# Altium schematic sheet MCU.SchDoc
size 420 x 297 mm; DocumentNumber: 4; SheetNumber: 4; SheetTotal: 5; Обозначение_Код: RIG-00.00.001 Э3
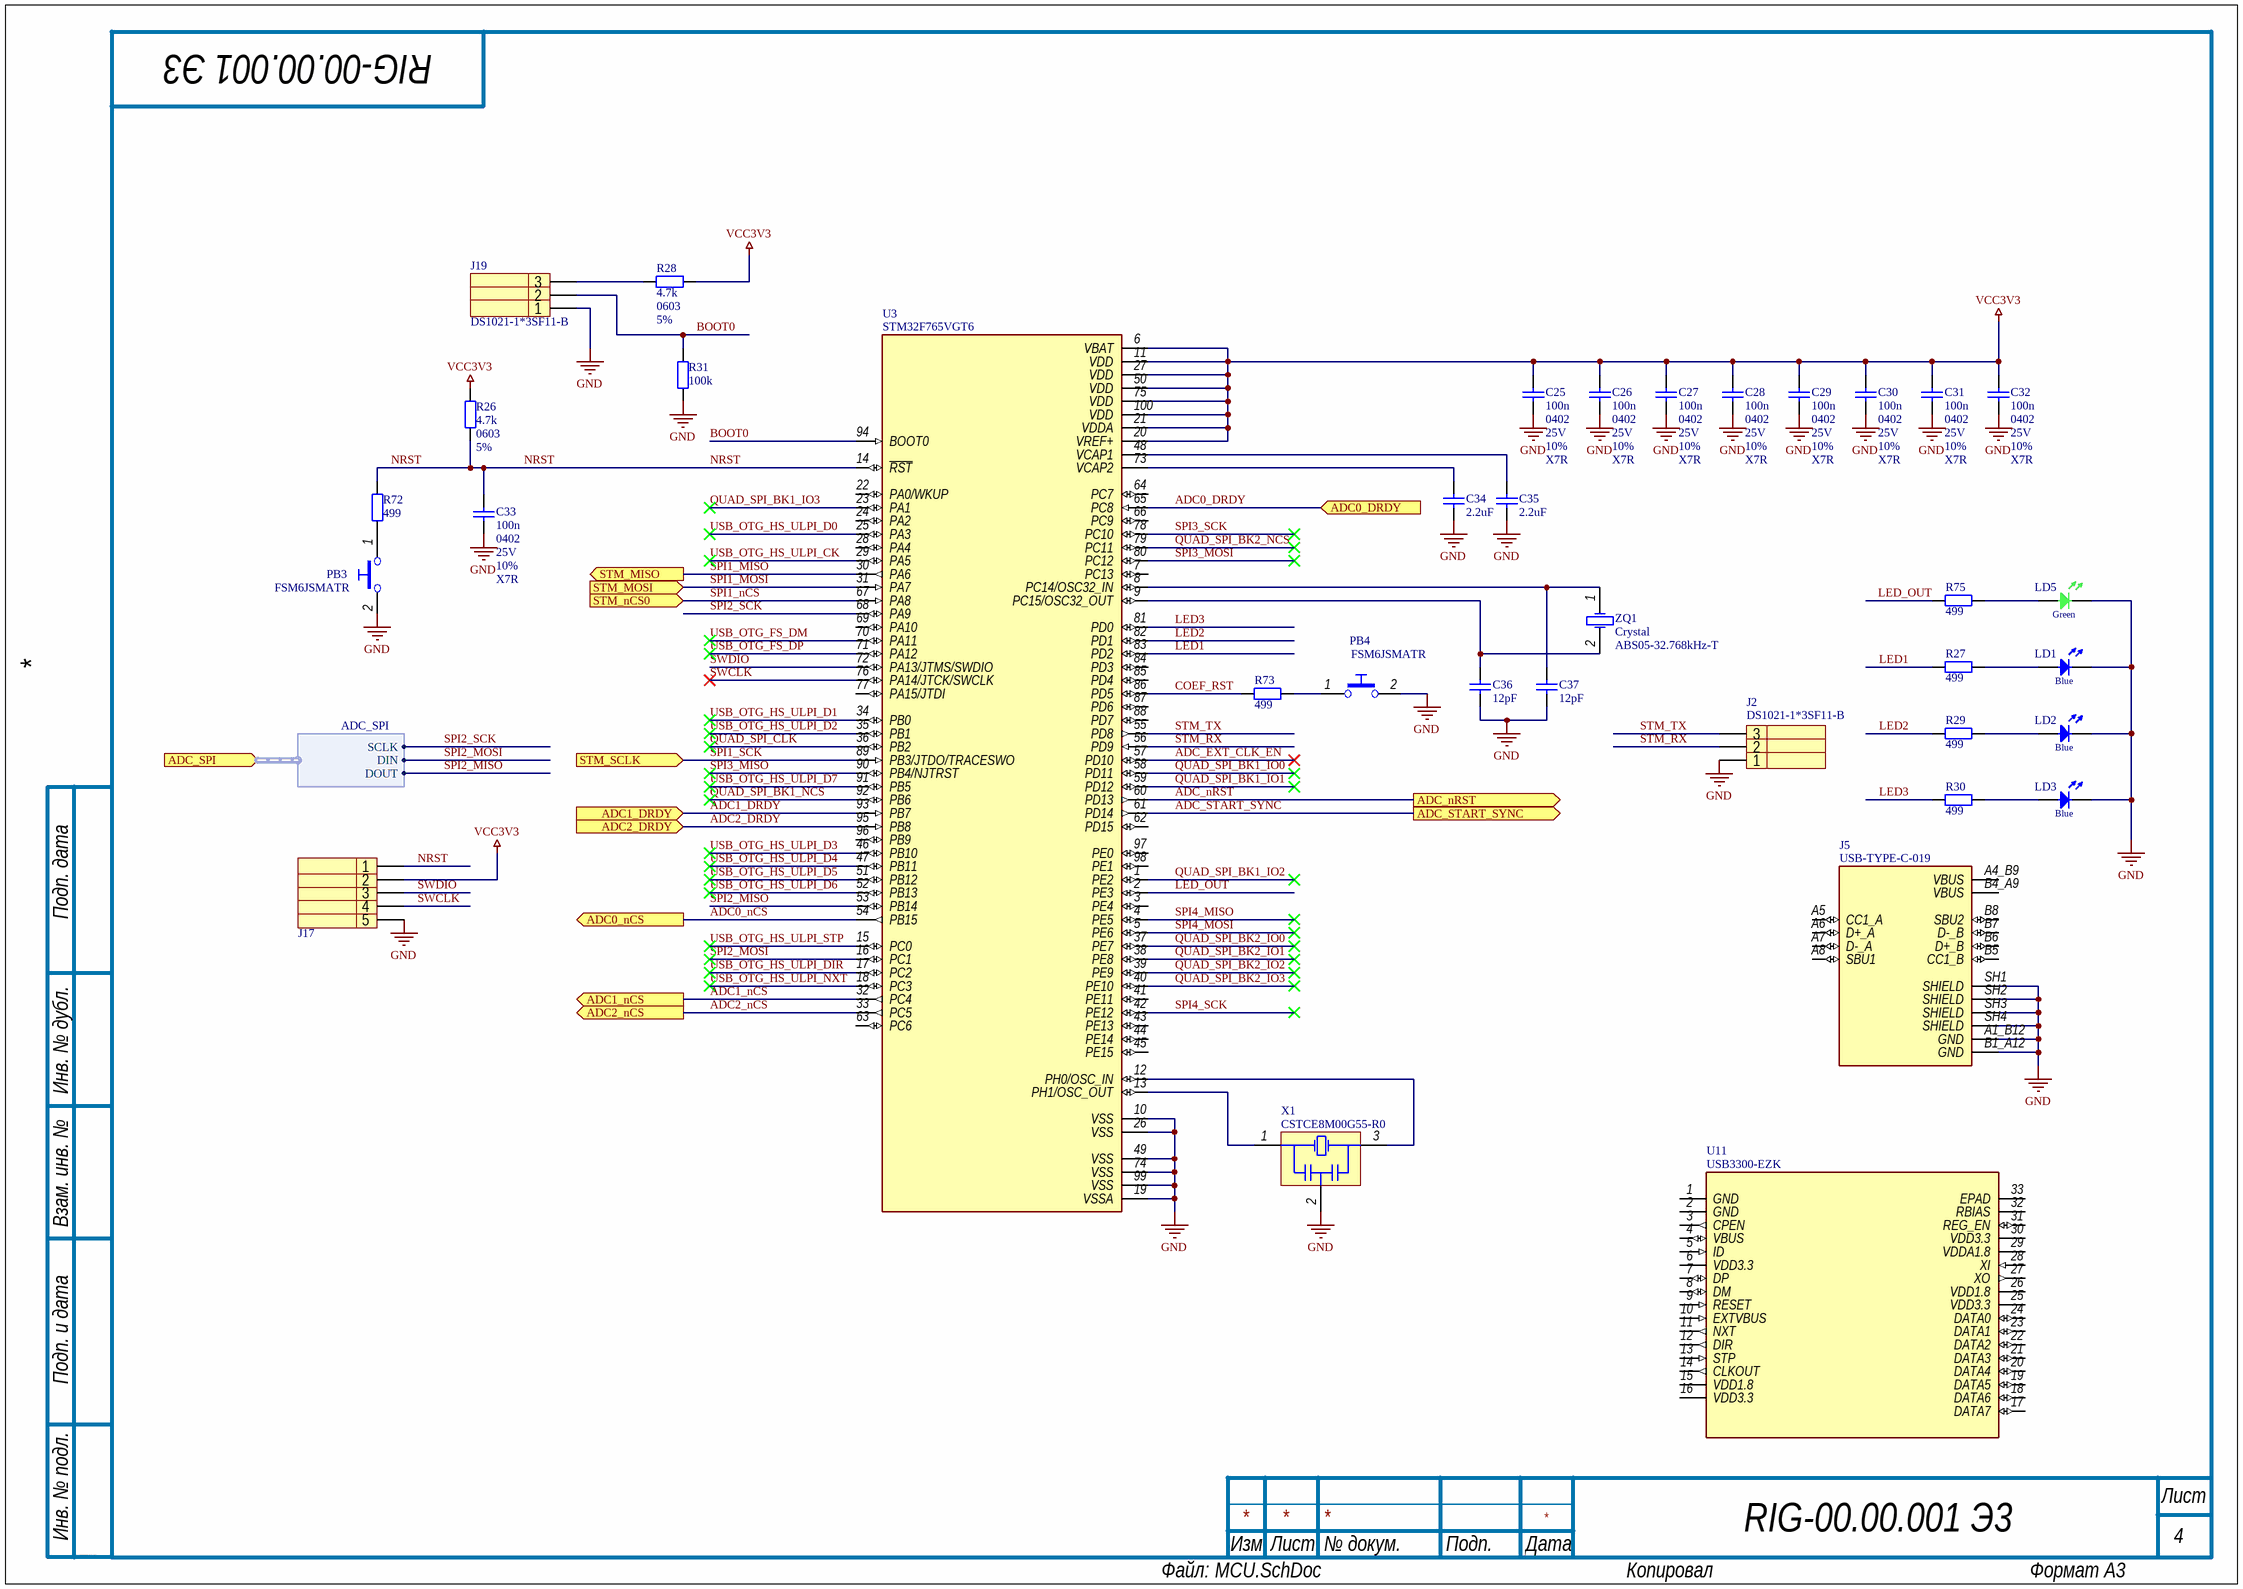
[diagram p0: MCU.SchDoc]

## Parts
C25  100n  Device: 0402  Voltage: 25V  Tolerance: 10%  Dielectric Type: X7R  [CAPC1005X55N]
C26  100n  Device: 0402  Voltage: 25V  Tolerance: 10%  Dielectric Type: X7R  [CAPC1005X55N]
C27  100n  Device: 0402  Voltage: 25V  Tolerance: 10%  Dielectric Type: X7R  [CAPC1005X55N]
C28  100n  Device: 0402  Voltage: 25V  Tolerance: 10%  Dielectric Type: X7R  [CAPC1005X55N]
C29  100n  Device: 0402  Voltage: 25V  Tolerance: 10%  Dielectric Type: X7R  [CAPC1005X55N]
C30  100n  Device: 0402  Voltage: 25V  Tolerance: 10%  Dielectric Type: X7R  [CAPC1005X55N]
C31  100n  Device: 0402  Voltage: 25V  Tolerance: 10%  Dielectric Type: X7R  [CAPC1005X55N]
C32  100n  Device: 0402  Voltage: 25V  Tolerance: 10%  Dielectric Type: X7R  [CAPC1005X55N]
C33  100n  Device: 0402  Voltage: 25V  Tolerance: 10%  Dielectric Type: X7R  [CAPC1005X55N]
C34  2.2uF  [CAPC1005X55N]
C35  2.2uF  [CAPC1005X55N]
C36  12pF  [CAPC1005X55N]
C37  12pF  [CAPC1005X55N]
J2  DS1021-1*3SF11-B  [PLS-3]
J5  USB-TYPE-C-019  [AMPHENOL_12402012E212A]
J17  DS1021-1*5SF11-B  [PLS-5]  (value not drawn)
J19  DS1021-1*3SF11-B  [PLS-3]
LD1  Blue  [0603(LED_B)]  (value not drawn)
LD2  Blue  [0603(LED_B)]  (value not drawn)
LD3  Blue  [0603(LED_B)]  (value not drawn)
LD5  Green  [LD-3mm-G]  (value not drawn)
PB3  FSM6JSMATR  [FSMxJSMA-Series]
PB4  FSM6JSMATR  [FSMxJSMA-Series]
R26  4.7k  Device: 0603  Tolerance: 5%  [RESC1608X50N]
R27  499  [RESC1005X40N]
R28  4.7k  Device: 0603  Tolerance: 5%  [RESC1608X50N]
R29  499  [RESC1005X40N]
R30  499  [RESC1005X40N]
R31  100k  [RESC1005X40N]
R72  499  [RESC1005X40N]
R73  499  [RESC1005X40N]
R75  499  [RESC1005X40N]
U3  STM32F765VGT6  [LQFP100_L]
U11  USB3300-EZK  [QFN32_5X5MC_MCH]
X1  CSTCE8M00G55-R0  [MURA-CSTCE_G_A-3_V]
ZQ1  Crystal  Part Number: ABS05-32.768kHz-T  [FP-ABS05-MFG]

## Ports
ADC0_DRDY (in), ADC0_nCS (out), ADC1_DRDY (in), ADC1_nCS (out), ADC2_DRDY (in), ADC2_nCS (out), ADC_nRST (out), ADC_SPI (in, harness ADC_SPI), ADC_START_SYNC (out), STM_MISO (out), STM_MOSI (in), STM_nCS0 (in), STM_SCLK (in)

## Harnesses
ADC_SPI: DIN, DOUT, SCLK

## Nets
GND: C25.1 C26.1 C27.1 C28.1 C29.1 C30.1 C31.1 C32.1 C33.1 C34.1 C35.1 C36.1 C37.1 J2.1 J5.A1_B12(GND) J5.B1_A12(GND) J5.SH1(SHIELD) J5.SH2(SHIELD) J5.SH3(SHIELD) J5.SH4(SHIELD) J17.5 J19.1 LD1.2(C) LD2.2(C) LD3.2(C) LD5.2(C) PB3.2 PB4.2 R31.1 U3.10(VSS) U3.19(VSSA) U3.26(VSS) U3.49(VSS) U3.74(VSS) U3.99(VSS) X1.2(GND)
VCC3V3: C25.2 C26.2 C27.2 C28.2 C29.2 C30.2 C31.2 C32.2 J17.2 R26.2 R28.2 U3.6(VBAT) U3.11(VDD) U3.20(VREF+) U3.21(VDDA) U3.27(VDD) U3.50(VDD) U3.75(VDD) U3.100(VDD)
ADC0_DRDY: U3.65(PC8) ; port ADC0_DRDY
ADC0_nCS: U3.54(PB15) ; port ADC0_nCS
ADC1_DRDY: U3.93(PB7) ; port ADC1_DRDY
ADC1_nCS: U3.32(PC4) ; port ADC1_nCS
ADC2_DRDY: U3.95(PB8) ; port ADC2_DRDY
ADC2_nCS: U3.33(PC5) ; port ADC2_nCS
ADC_EXT_CLK_EN: U3.57(PD10)
ADC_nRST: U3.60(PD13) ; port ADC_nRST
ADC_START_SYNC: U3.61(PD14) ; port ADC_START_SYNC
BOOT0: J19.2 R31.2 U3.94(BOOT0)
COEF_RST: R73.2 U3.86(PD5)
LED1: R27.1 U3.83(PD2)
LED2: R29.1 U3.82(PD1)
LED3: R30.1 U3.81(PD0)
LED_OUT: R75.1 U3.2(PE3)
NRST: C33.2 J17.1 R26.1 R72.2 U3.14(~{RST})
QUAD_SPI_BK1_IO0: U3.58(PD11)
QUAD_SPI_BK1_IO1: U3.59(PD12)
QUAD_SPI_BK1_IO2: U3.1(PE2)
QUAD_SPI_BK1_IO3: U3.23(PA1)
QUAD_SPI_BK1_NCS: U3.92(PB6)
QUAD_SPI_BK2_IO0: U3.37(PE7)
QUAD_SPI_BK2_IO1: U3.38(PE8)
QUAD_SPI_BK2_IO2: U3.39(PE9)
QUAD_SPI_BK2_IO3: U3.40(PE10)
QUAD_SPI_BK2_NCS: U3.79(PC11)
QUAD_SPI_CLK: U3.36(PB2)
SPI1_MISO: U3.30(PA6) ; port STM_MISO
SPI1_MOSI: U3.31(PA7) ; port STM_MOSI
SPI1_nCS: U3.67(PA8) ; port STM_nCS0
SPI1_SCK: U3.89(PB3/JTDO/TRACESWO) ; port STM_SCLK
SPI2_MISO: U3.53(PB14) ; port ADC_SPI.DOUT
SPI2_MOSI: U3.16(PC1) ; port ADC_SPI.DIN
SPI2_SCK: U3.68(PA9) ; port ADC_SPI.SCLK
SPI3_MISO: U3.90(PB4/NJTRST)
SPI3_MOSI: U3.80(PC12)
SPI3_SCK: U3.78(PC10)
SPI4_MISO: U3.4(PE5)
SPI4_MOSI: U3.5(PE6)
SPI4_SCK: U3.42(PE12)
STM_RX: J2.2 U3.56(PD9)
STM_TX: J2.3 U3.55(PD8)
SWCLK: J17.4 U3.76(PA14/JTCK/SWCLK)
SWDIO: J17.3 U3.72(PA13/JTMS/SWDIO)
USB_OTG_FS_DM: U3.70(PA11)
USB_OTG_FS_DP: U3.71(PA12)
USB_OTG_HS_ULPI_CK: U3.29(PA5)
USB_OTG_HS_ULPI_D0: U3.25(PA3)
USB_OTG_HS_ULPI_D1: U3.34(PB0)
USB_OTG_HS_ULPI_D2: U3.35(PB1)
USB_OTG_HS_ULPI_D3: U3.46(PB10)
USB_OTG_HS_ULPI_D4: U3.47(PB11)
USB_OTG_HS_ULPI_D5: U3.51(PB12)
USB_OTG_HS_ULPI_D6: U3.52(PB13)
USB_OTG_HS_ULPI_D7: U3.91(PB5)
USB_OTG_HS_ULPI_DIR: U3.17(PC2)
USB_OTG_HS_ULPI_NXT: U3.18(PC3)
USB_OTG_HS_ULPI_STP: U3.15(PC0)
NetC34_2: C34.2 U3.73(VCAP2)
NetC35_2: C35.2 U3.48(VCAP1)
NetC36_2: C36.2 U3.9(PC15/OSC32_OUT) ZQ1.2(OSC2)
NetC37_2: C37.2 U3.8(PC14/OSC32_IN) ZQ1.1(OSC1)
NetJ19_3: J19.3 R28.1
NetLD1_1: LD1.1(A) R27.2
NetLD2_1: LD2.1(A) R29.2
NetLD3_1: LD3.1(A) R30.2
NetLD5_1: LD5.1(A) R75.2
NetPB3_1: PB3.1 R72.1
NetPB4_1: PB4.1 R73.1
NetU3_12: U3.12(PH0/OSC_IN) X1.3(X2)
NetU3_13: U3.13(PH1/OSC_OUT) X1.1(X1)

Not connected (* = marked no-connect by the designer): J5 A4_B9(VBUS) A5(CC1_A) A6(D+_A) A7(D-_A) A8(SBU1) B4_A9(VBUS) B5(CC1_B) B6(D+_B) B7(D-_B) B8(SBU2); U3 3(PE4) 7(PC13) 22(PA0/WKUP) 24(PA2) 28(PA4) 41(PE11) 43(PE13) 44(PE14) 45(PE15) 62(PD15) 63(PC6) 64(PC7) 66(PC9) 69(PA10) 77(PA15/JTDI) 84(PD3) 85(PD4) 87(PD6) 88(PD7) 96(PB9) 97(PE0) 98(PE1); U11 1(GND) 2(GND) 3(CPEN) 4(VBUS) 5(ID) 6(VDD3.3) 7(DP) 8(DM) 9(RESET) 10(EXTVBUS) 11(NXT) 12(DIR) 13(STP) 14(CLKOUT) 15(VDD1.8) 16(VDD3.3) 17(DATA7) 18(DATA6) 19(DATA5) 20(DATA4) 21(DATA3) 22(DATA2) 23(DATA1) 24(DATA0) 25(VDD3.3) 26(VDD1.8) 27(XO) 28(XI) 29(VDDA1.8) 30(VDD3.3) 31(REG_EN) 32(RBIAS) 33(EPAD)

## Notes on the sheet
- Подп. дата
- Инв. № дубл.
- Взам. инв. №
- Подп. и дата
- Инв. № подл.
- Изм.
- Лист
- № докум.
- Подп.
- Дата
- ALTIUM GOSTBOM2.0 KEV
- Файл:
- Копировал
- Формат А3

## Library data of the parts
C25-C33 = GRM155R71E104KE14D: CAP CER 0402 100n 25V X7R; Manufacturer: Murata; ID: 4; Type: Resistor; Packaging Type: Cut Tape; Working Temperature Min: -55°С; Working Temperature Max: +125°С; Table: Capacitor SMT - Керамические; Part Number: GRM155R71E104KE14D; Value: 100n; Series: GRM; SMD: Yes; Manufacturer Part Number: GRM155R71E104KE14D; Status: Active; Price: 0; Price2: 0; Price3: 0; Author: Krepak V.; CreateDate: 23.02.2020
C34 C35 = GRM155R61A225KE95D: CAP CER 0402 2.2uF 10V X5R; Manufacturer: Murata; ID: 36; Device: 0402; Tolerance: 10%; Type: Resistor; Packaging Type: Cut Tape; Working Temperature Min: -55°С; Working Temperature Max: +85°С; Table: Capacitor SMT - Керамические; Part Number: GRM155R61A225KE95D; Value: 2.2uF; Voltage: 10V; Dielectric Type: X5R; Series: GRM; SMD: Yes; Manufacturer Part Number: GRM155R61A225KE95D; Datasheet URL: #https://search.murata.co.jp/Ceramy/image/img/A01X/G101/ENG/GRM155R61A225KE95-01.pdf#; Status: Active; Price: 0; Price2: 0; Price3: 0; Author: Krepak V.; CreateDate: 31.03.2021
C36 C37 = GRM1555C1H120JA01D: CAP CER 0402 12pF 50V NP0; Manufacturer: Murata; ID: 49; Device: 0402; Tolerance: 5%; Type: Resistor; Packaging Type: Tape&Reel; Working Temperature Min: -55°С; Working Temperature Max: +125°С; Table: Capacitor SMT - Керамические; Part Number: GRM1555C1H120JA01D; Value: 12pF; Voltage: 50V; Dielectric Type: NP0; Series: GRM; SMD: Yes; Manufacturer Part Number: GRM1555C1H120JA01D; Datasheet URL: #https://search.murata.co.jp/Ceramy/image/img/A01X/G101/ENG/GRM1555C1H120JA01-01.pdf#; Status: Not recommended; Price: 0; Price2: 0; Price3: 0; Author: Krepak V.; CreateDate: 22.04.2021; Supplier 1: Digikey; Supplier Part Number 1: 490-5924-2-ND
J2 J19 = DS1021-1*3SF11-B: Manufacturer: CONNFLY; ID: 13; Limit Voltage: 500 V AC(1 min); Resistance: 20 mOhm(max); Pitch: 2.54mm; Working Temperature Min: -20°С; Working Temperature Max: +70°С; Table: Connectors - Общ; Part Number: DS1021-1*3SF11-B; Device: PLS-3; Pins: 3; Type: Connector; SMD: No; Datasheet URL: #https://static.chipdip.ru/lib/227/DOC000227157.pdf#; Status: Active; Price: 0; Price2: 0; Price3: 0; Author: Arshanitsa D.; CreateDate: 19.08.2020
J5 = USB-TYPE-C-019: 1 16P -25℃~+85℃ Type-C SMD USB, DVI, HDMI Connector Assemblies RoHS; MF: Amphenol ICC (Commercial Products); ID: 36; Table: Connectors - Интерфейсы; MP: 12402012E212A; Price: 0; Package: None; Availability: In Stock; SnapEDA_Link: https://www.snapeda.com/parts/12402012E212A/Amphenol/view-part/?ref=snap; Check_prices: https://www.snapeda.com/parts/12402012E212A/Amphenol/view-part/?ref=eda; Purchase-URL: https://pricing.snapeda.com/search/part/12402012E212A/?ref=eda; Part Number: USB-TYPE-C-019; Device: USB-TYPE-C-019; Pins: 16+8; Type: Connector; Price2: 0; Price3: 0
J17 = DS1021-1*5SF11-B: Manufacturer: CONNFLY; ID: 12; Limit Voltage: 500 V AC (1 min); Resistance: 20 mOhm(max); Pitch: 2.54mm; Working Temperature Min: -20; Working Temperature Max: +70°С; Table: Connectors - Общ; Part Number: DS1021-1*5SF11-B; Device: PLS-5; Pins: 5; Type: Connector; SMD: No; Datasheet URL: #https://static.chipdip.ru/lib/227/DOC000227157.pdf#; Status: Active; Price: 0; Price2: 0; Price3: 0; Author: Arshanitsa D.; CreateDate: 09.06.2020
LD1-LD3 = LTST-C191TBKT-5A: DIODE LTST-C191TBKT-5A; ID: 9; Packaging Type: Cut Tape; Table: Diodes SMT - Светодиоды; Part Number: LTST-C191TBKT-5A; Device: LTST-C191TBKT-5A; Value: LTST-C191TBKT-5A; Color: Blue; Type: Diode; SMD: Yes; Manufacturer Part Number: LTST-C191TBKT-5A; Datasheet URL: #https://jlcpcb.com/partdetail/liteon-LTST_C191TBKT5A/C161620#; Status: Active; Price: 0; Price2: 0; Price3: 0; Author: Krepak V.; CreateDate: 18.02.2024
LD5 = GNL-3012GD: DIODE GREEN; Manufacturer: G-NOR OPTOELECTRONICS; ID: 2; Reverse Voltage: 5V; Reverse Current: 10uA; Forward Current: 30mA; Luminous Flux: 7uCd; Number of LEDs: 1; Notes: 565nm 60deg; Packaging Type: Bulk; Table: Diodes THM - Светодиоды; Part Number: GNL-3012GD; Device: GREEN; Color: Green; Series: GNL-3012xx; Type: Diode; SMD: No; Manufacturer Part Number: GNL-3012GD; Datasheet URL: #https://static.chipdip.ru/lib/773/DOC002773602.pdf#; Status: Active; Distributor: chipdip; Price: 0; Price2: 0; Price3: 0; DistributorURL: #https://www.chipdip.ru/product/gnl-3012gd#; Author: Krepak V.; CreateDate: 25.08.2020; LatestRevisionDate: 25.08.2020
PB3 PB4 = FSM6JSMATR: Tactile Switch SPST-NO Top Actuated Surface Mount; Manufacturer: Te Connectivity; ID: 3; Device: TACT; Limit Voltage: 24VDC; Limit Current: 50mA; Working Temperature Min: -35°С; Working Temperature Max: +85°С; Table: Misc - Переключатели Кнопочные; Part Number: FSM6JSMATR; Series: FSMJSM; Type: Misc; SMD: Yes; Manufacturer Part Number: FSM6JSMATR; Datasheet URL: #https://www.terraelectronica.ru/pdf/show?pdf_file=http%253A%252F%252Fwww.farnell.com%252Fcad%252F1922404.pdf#; Status: Active; Distributor: terraelectronica; Price: 0; Price2: 0; Price3: 0; DistributorURL: #https://www.terraelectronica.ru/product/972320#; Author: Krepak V.; CreateDate: 31.08.2020
R26 R28 = RC0603JR-074K7L: RES 0603 4.7k 5%; Manufacturer: Yageo; ID: 29; Limit Voltage: 75V; Temperature Coefficient: 100ppm; Total Power Dissipation: 0.1W; Packaging Type: Cut Tape; Replacement: CR-03JL7---4K7, CRCW06034K70JNEA; Library Ref 2: Resistor2; Library Ref 3: Resistor3; Library Path 2: Resistors.SchLib; Application Category: 1; Working Temperature Min: -55°С; Working Temperature Max: +155°С; Table: Resistor SMT - Постоянные; Part Number: RC0603JR-074K7L; Value: 4.7k; Series: RC; Type: Resistor; Material: Thick-Film; SMD: Yes; Manufacturer Part Number: RC0603JR-074K7L; Datasheet URL: #https://www.terraelectronica.ru/pdf/show?pdf_file=%252Fds%252Fpdf%252FR%252FRC0603%255B1%255D.pdf#; Status: Active; Distributor: terraelectronica; Price: 0; Price2: 0; Price3: 0; DistributorURL: #https://www.terraelectronica.ru/product/540975#; Author: Krepak V.; CreateDate: 06.07.2020
R27 R29 R30 R72 R73 R75 = RC0402FR-07499RL: RES 0402 499 1%; Manufacturer: Yageo; ID: 90; Device: 0402; Limit Voltage: 50V; Temperature Coefficient: 100ppm; Total Power Dissipation: 0.0625W; Packaging Type: Tape&Reel; Library Ref 2: Resistor2; Library Ref 3: Resistor3; Library Path 2: Resistors.SchLib; Application Category: 1; Working Temperature Min: -55°С; Working Temperature Max: +155°С; Table: Resistor SMT - Постоянные; Part Number: RC0402FR-07499RL; Value: 499; Tolerance: 1%; Series: RC_L; Type: Resistor; Material: Thick-Film; SMD: Yes; Manufacturer Part Number: RC0402FR-07499RL; Datasheet URL: #https://www.yageo.com/upload/media/product/productsearch/datasheet/rchip/PYu-RC_Group_51_RoHS_L_11.pdf#; Status: Active; Distributor2: Jul. 7, 2020 V.11; Price: 0; Price2: 0; Price3: 0; Author: Krepak V.; CreateDate: 01.02.2022; Supplier 1: Digikey; Supplier Part Number 1: 311-499LRTR-ND
R31 = RC0402FR-07100KL: RES 0402 100k 1%; Manufacturer: Yageo; ID: 2; Device: 0402; Limit Voltage: 50V; Temperature Coefficient: 100ppm; Total Power Dissipation: 0.0625W; Packaging Type: Cut Tape; Library Ref 2: Resistor2; Library Ref 3: Resistor3; Library Path 2: Resistors.SchLib; Application Category: 1; Working Temperature Min: -55°С; Working Temperature Max: +155°С; Table: Resistor SMT - Постоянные; Part Number: RC0402FR-07100KL; Value: 100k; Tolerance: 1%; Series: RC; Type: Resistor; Material: Thick-Film; SMD: Yes; Price: 0; Price2: 0; Price3: 0; Author: Krepak V.; CreateDate: 23.02.2020
U3 = STM32F765VGT6: ARM® Cortex®-M7 STM32F7 Microcontroller IC 32-Bit Single-Core 216MHz 1MB (1M x 8) FLASH 100-LQFP (14x14); Manufacturer: ST Microelectronics; MF: STMicroelectronics; MP: STM32F765VGT6TR; ID: 12; Supply Operation: 1.7V ~ 3.6V; SRAM: 512K x 8; Prog Interface: SWD, JTAG; I/O Lines: 82; Packaging Type: Tape&Reel; Working Temperature Min: -40°С; Working Temperature Max: +85°С; Table: IC - Микроконтроллеры; Package: LQFP-100 STMicroelectronics; Price: 0; Check_prices: https://www.snapeda.com/parts/STM32F765VGT6TR/STMicroelectronics/view-part/?ref=eda; Value: 100-LQFP; SnapEDA_Link: https://www.snapeda.com/parts/STM32F765VGT6TR/STMicroelectronics/view-part/?ref=snap; Availability: In Stock; Purchase-URL: https://pricing.snapeda.com/search?q=STM32F765VGT6TR&ref=eda; Part Number: STM32F765VGT6; Device: STM32F765VGT6; Series: STM32F7; Flash: 1MB (1M x 8); Operation Frequency: 216MHz; Type: IC; SMD: Yes; Manufacturer Part Number: STM32F765VGT6; Datasheet URL: #https://www.st.com/resource/en/datasheet/stm32f765vg.pdf#; Datasheet Version: August 2023; Status: Active; Price2: 0; Price3: 0; Author: Krepak V.; CreateDate: 04.04.2024
U11 = USB3300-EZK: USB Controller USB 2.0, OTG ULPI Interface 32-QFN (5x5); Manufacturer_Name: Microchip; Manufacturer: Microchip Technology; ID: 30; Supply Operation: 3V ~ 3.6V; Working Temperature Min: -40°С; Working Temperature Max: +85°С; Table: IC - Микросхемы интерфейсов; Copyright: Copyright (C) 2025 Ultra Librarian. All rights reserved.; Manufacturer_Part_Number: USB3300-EZK; RefDes: RefDes; Type: IC; Part Number: USB3300-EZK; Device: USB3300-EZK; Value: 32-QFN (5x5); Protocol: USB 2.0, OTG; SMD: Yes; Manufacturer Part Number: USB3300-EZK; Status: Active; Price: 0; Price2: 0; Price3: 0; Author: Krepak V.; CreateDate: 01.12.2025; Supplier 1: Digikey; Supplier Part Number 1: 638-1034-ND
X1 = CSTCE8M00G55-R0: 8MHz ±0.5% 33pF SMD3213-3P Ceramic Resonators ROHS; Manufacturer: Murata; Frequency Stability: 0.2%; ID: 10; Device: Crystal; Packaging Type: Tape&Reel; Working Temperature Min: -40°С; Working Temperature Max: +125°С; Table: Crystal SMT - Кварцевые Резонаторы; Datasheet Version: Mar.17,2015; Capacitance: 33pF; RoHSCompliant: True; Datasheet URL: #https://jlcpcb.com/partdetail/MurataElectronics-CSTCE8M00G55R0/C70457#; Case/Package: Ceramic; Load Capacitance: 33pF; Tolerance: 0.5%; Self Resonant Frequency: 8MHz; Mount: SurfaceMount; Height: 0.031inch; Number of Pins: 3; Package Description: 3-Pin Surface Mount Device, Body 3.2 x 1.3 mm, Pitch 1.2 mm; Package Quantity: 1; Lead Free: LeadFree; Contact Plating: Gold; REACH SVHC: NoSVHC; Length: 0.126inch; Width: 0.051inch; Manufacturer URL: http://www.murata.com/; Packaging: TapeandReel; Termination: SMD/SMT; Frequency Tolerance: 0.5%; Max Operating Temperature: 80degC; Composition: Ceramic; Package Reference: CSTCE_G_A-3; Min Operating Temperature: -20degC; Frequency: 8MHz; Part Number: CSTCE8M00G55-R0; Output Frequency: 8MHz; Temperature Coefficient: ±0.5%; Type: Crystal; SMD: Yes; Manufacturer Part Number: CSTCE8M00G55-R0; Status: Active; Price: 0; Price2: 0; Price3: 0; Author: Krepak V.; CreateDate: 21.02.2024
ZQ1 = ABS05-32.768kHz-T: 32.768kHz 12.5pF ±20ppm SMD1610-2P Crystals ROHS; Manufacturer: Abracon; ID: 9; Packaging Type: Tape&Reel; Working Temperature Min: -40°С; Working Temperature Max: +85°С; Table: Crystal SMT - Кварцевые Резонаторы; Device: Crystal; Output Frequency: 32.768kHz; Load Capacitance: 12.5pF; Type: Crystal; SMD: Yes; Manufacturer Part Number: ABS05-32.768kHz-T; Datasheet URL: #https://jlcpcb.com/partdetail/AbraconLlc-ABS05_32_768kHzT/C179633#; Datasheet Version: Revised: 06.03.15; Status: Active; Price: 0; Price2: 0; Price3: 0; Author: Krepak V.; CreateDate: 21.02.2024